# Altium project Battery Reader.PrjPcb
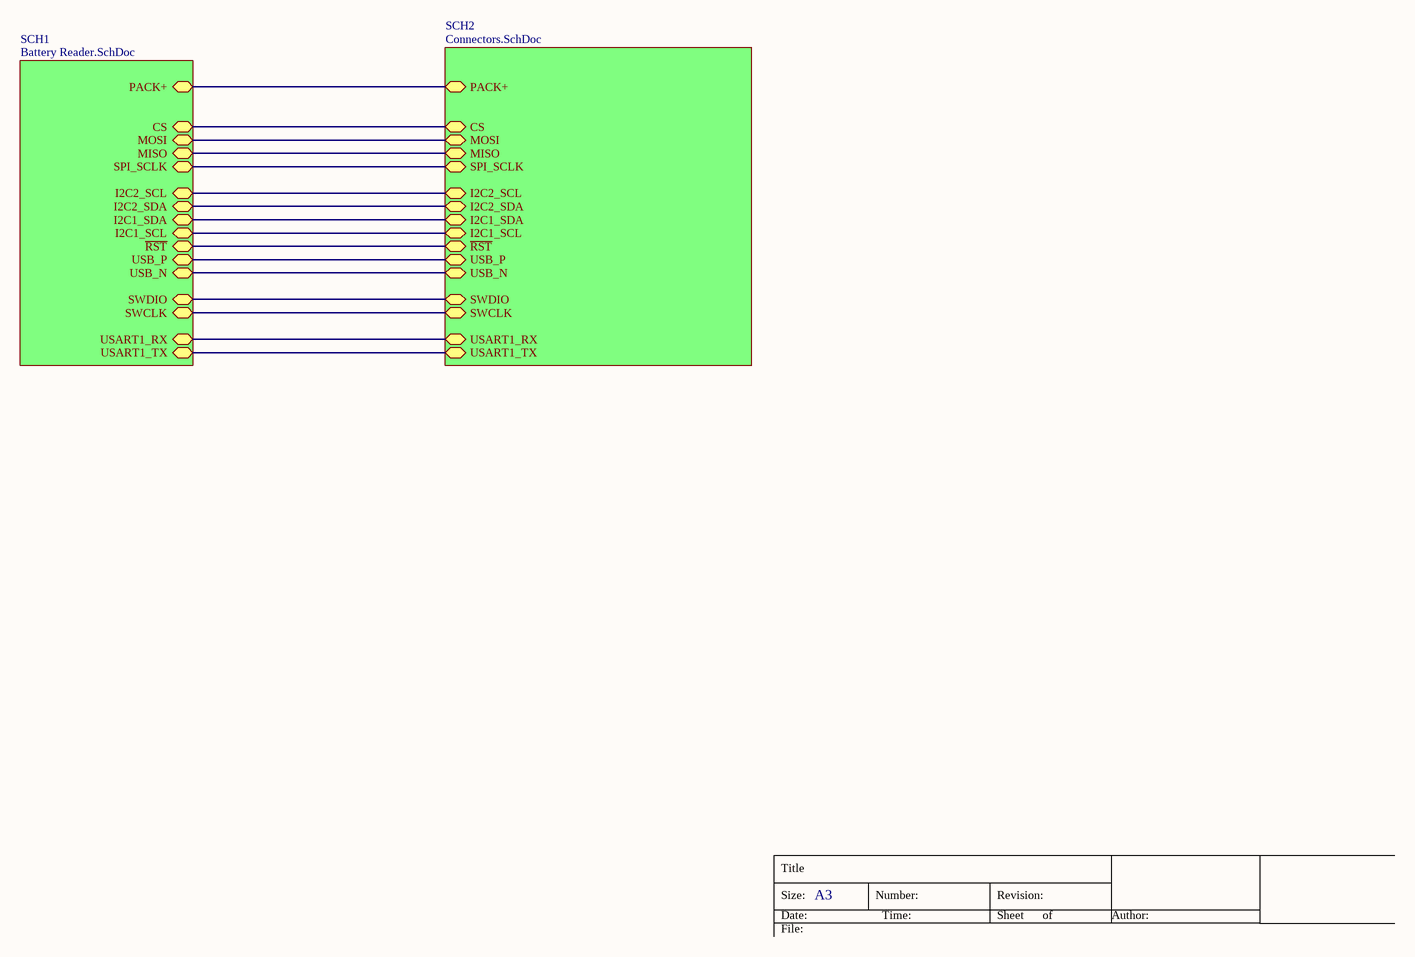
[diagram p0: Toplevel.SchDoc]
3 sheets, 73 parts. Net scope: hierarchical (ports join the sheet entries above them; power ports are global).
Board file: Battery Reader.PcbDoc
Sheets:
  Toplevel.SchDoc
    SCH1 = Battery Reader.SchDoc
    SCH2 = Connectors.SchDoc

## Sheet Toplevel.SchDoc: Toplevel
size A3; Author: Borja Serra; CompanyName: Blueye Robotics; Organization: Blueye Robotics AS; Address1: Transittgata 10; Address2: 7042 Trondheim; Address3: Norway; Revision: 0; SheetNumber: 1; SheetTotal: 3

### Sub-sheets
SCH1 = Battery Reader.SchDoc: CS, ~{RST}, MOSI, MISO, SPI_SCLK, USB_P, USB_N, I2C1_SDA, I2C1_SCL, PACK+, SWDIO, USART1_RX, SWCLK, USART1_TX, I2C2_SCL, I2C2_SDA
SCH2 = Connectors.SchDoc: CS, MISO, USB_P, MOSI, SPI_SCLK, I2C1_SCL, I2C1_SDA, ~{RST}, USB_N, PACK+, SWDIO, USART1_TX, USART1_RX, SWCLK, I2C2_SCL, I2C2_SDA

### Nets
I2C1_SCL: sheet SCH1/I2C1_SCL, sheet SCH2/I2C1_SCL
I2C1_SDA: sheet SCH1/I2C1_SDA, sheet SCH2/I2C1_SDA
PACK+: sheet SCH1/PACK+, sheet SCH2/PACK+
~{RST}: sheet SCH1/~{RST}, sheet SCH2/~{RST}
SWCLK: sheet SCH1/SWCLK, sheet SCH2/SWCLK
SWDIO: sheet SCH1/SWDIO, sheet SCH2/SWDIO
USART1_RX: sheet SCH1/USART1_RX, sheet SCH2/USART1_RX
USART1_TX: sheet SCH1/USART1_TX, sheet SCH2/USART1_TX
USB_N: sheet SCH1/USB_N, sheet SCH2/USB_N
USB_P: sheet SCH1/USB_P, sheet SCH2/USB_P
NetConn2_5: sheet SCH1/MISO, sheet SCH2/MISO
NetConn2_6: sheet SCH1/MOSI, sheet SCH2/MOSI
NetConn2_7: sheet SCH1/SPI_SCLK, sheet SCH2/SPI_SCLK
NetConn2_8: sheet SCH1/CS, sheet SCH2/CS
NetP1_D5: sheet SCH1/I2C2_SDA, sheet SCH2/I2C2_SDA
NetP1_D6: sheet SCH1/I2C2_SCL, sheet SCH2/I2C2_SCL

### Notes on the sheet
- Title
- Size:
- Date:
- A3
- Number:
- Time:
- Revision:
- Sheet
- of
- Author:
- File:

## Sheet Battery Reader.SchDoc: Battery Reader
size A3; Author: Borja Serra; CompanyName: Blueye Robotics; Organization: Blueye Robotics AS; Address1: Transittgata 10; Address2: 7042 Trondheim; Address3: Norway; Revision: 0; SheetNumber: 2; SheetTotal: 3
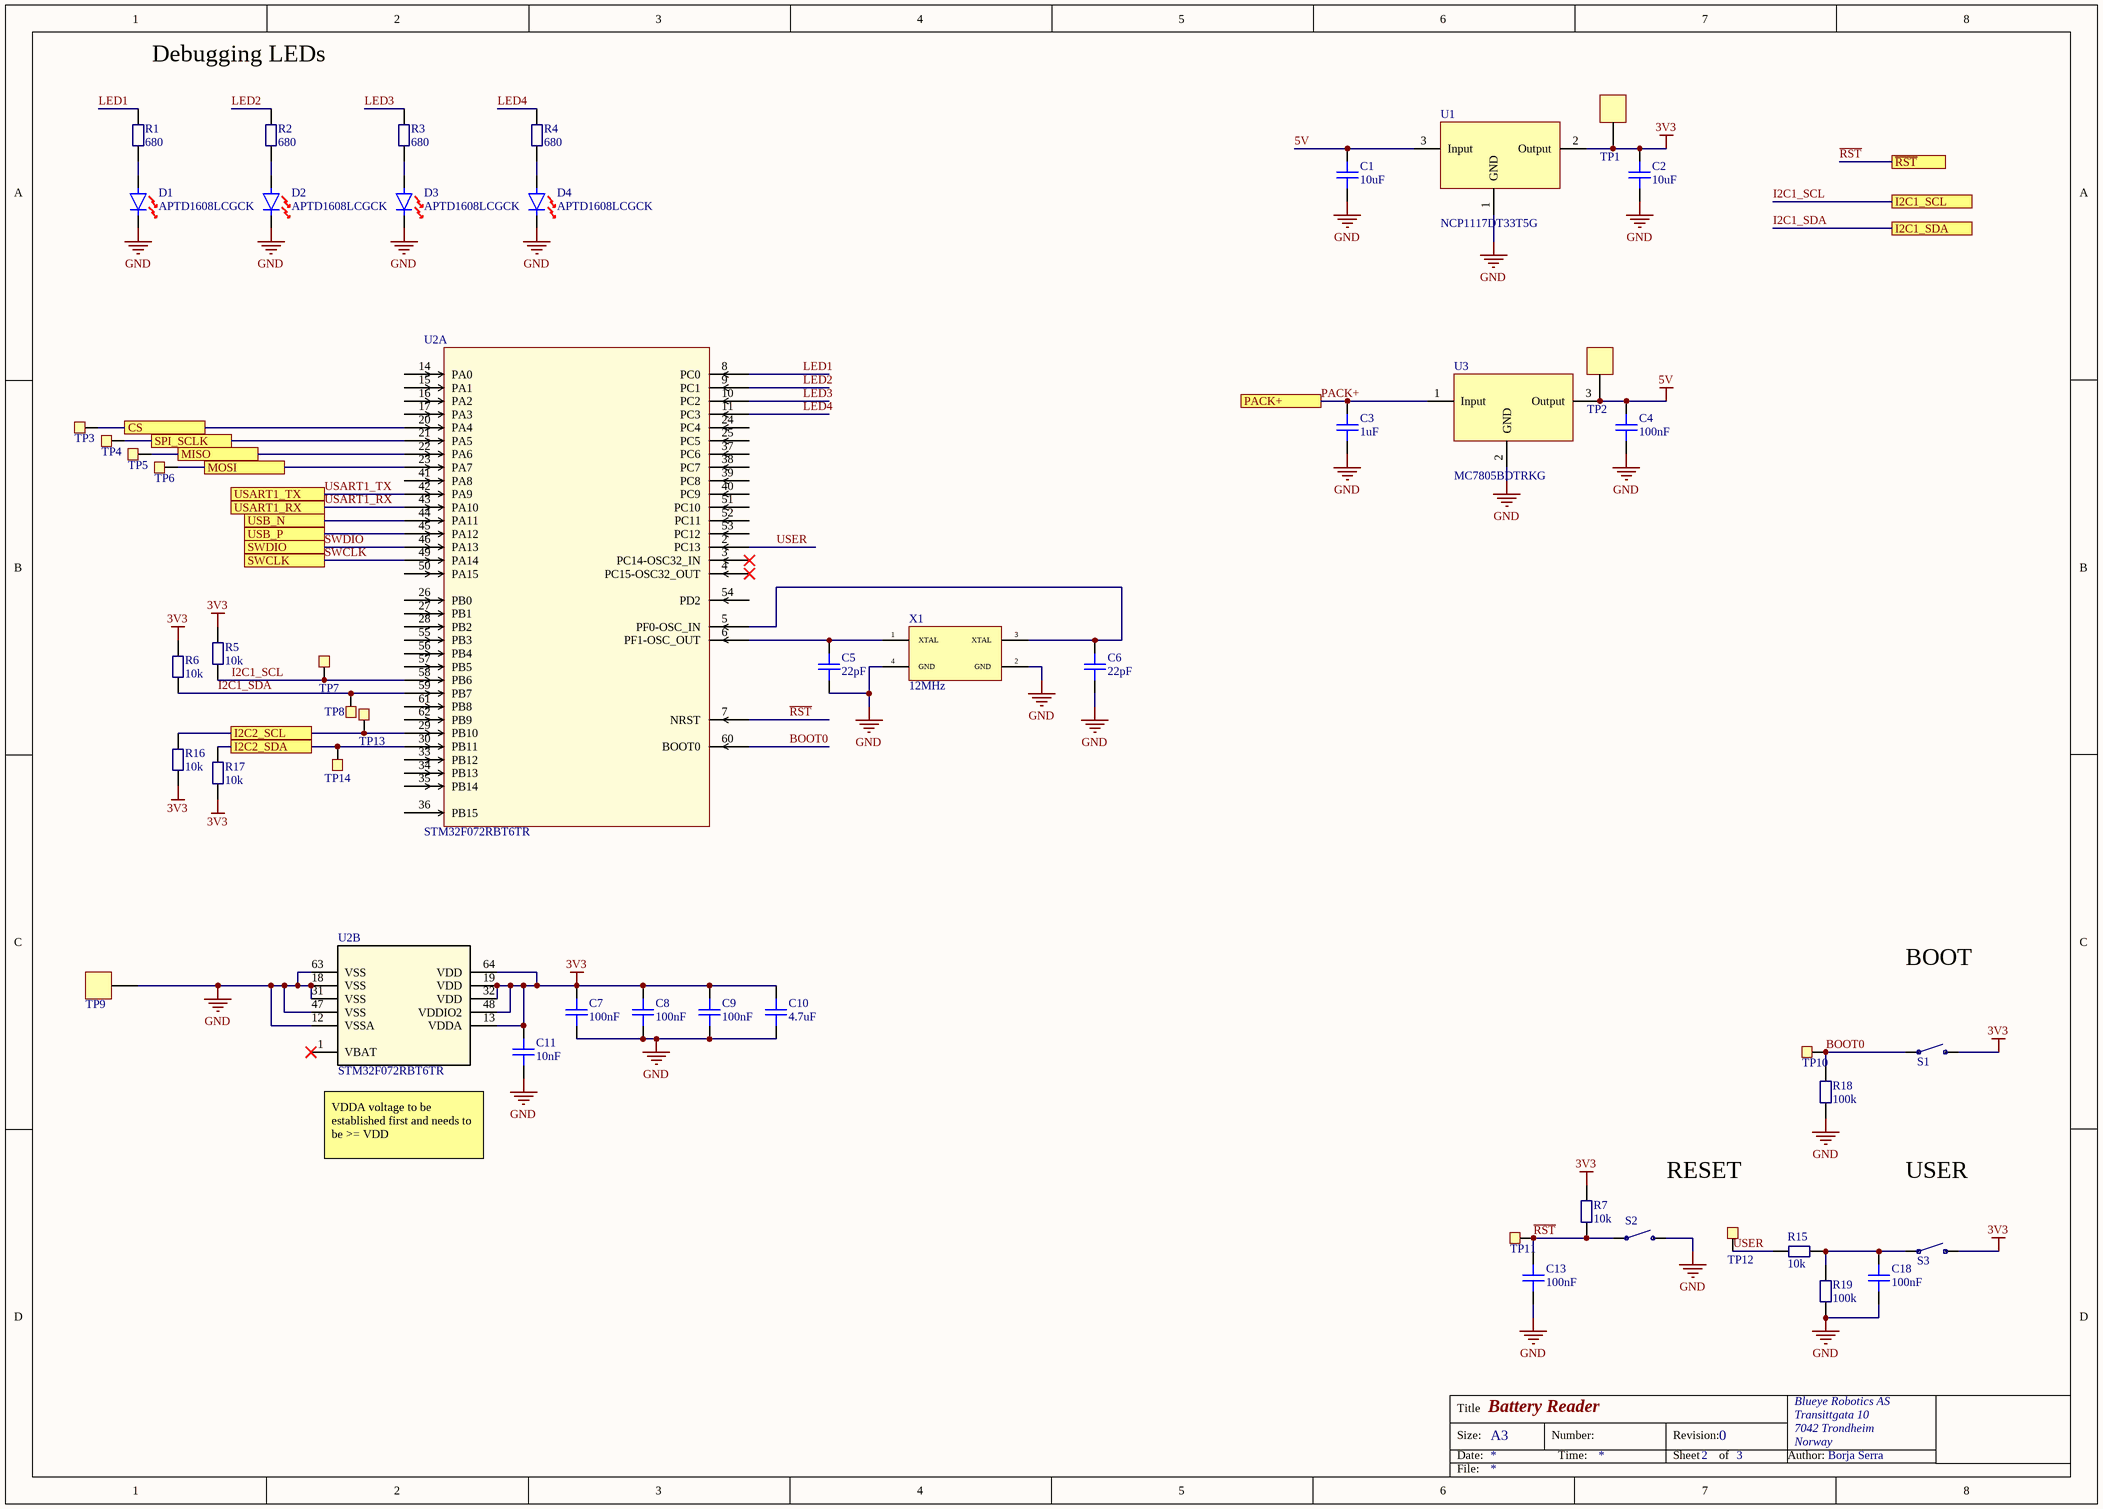
[diagram p1: Battery Reader.SchDoc]

### Parts
C1  10uF  [1206 CAPACITOR]
C2  10uF  [1206 CAPACITOR]
C3  1uF  [1206 CAPACITOR]
C4  100nF  [0603 Capacitor]
C5  22pF  [0603 Capacitor]
C6  22pF  [0603 Capacitor]
C7  100nF  [0603 Capacitor]
C8  100nF  [0603 Capacitor]
C9  100nF  [0603 Capacitor]
C10  4.7uF  [0805 Capacitor]
C11  10nF  [0603 Capacitor]
C13  100nF  [0603 Capacitor]
C18  100nF  [0603 Capacitor]
D1  APTD1608LCGCK  [0603 LED]
D2  APTD1608LCGCK  [0603 LED]
D3  APTD1608LCGCK  [0603 LED]
D4  APTD1608LCGCK  [0603 LED]
R1  680  [0603 Resistor]
R2  680  [0603 Resistor]
R3  680  [0603 Resistor]
R4  680  [0603 Resistor]
R5  10k  [0603 Resistor]
R6  10k  [0603 Resistor]
R7  10k  [0603 Resistor]
R15  10k  [0603 Resistor]
R16  10k  [0603 Resistor]
R17  10k  [0603 Resistor]
R18  100k  [0603 Resistor]
R19  100k  [0603 Resistor]
S1  Tactile Switches Reset  [Tact Switch - panasonic]  (value not drawn)
S2  Tactile Switches Reset  [Tact Switch - panasonic]  (value not drawn)
S3  Tactile Switches Reset  [Tact Switch - panasonic]  (value not drawn)
TP1  3122-2-00-15-00-00-08-0  [3122-2-00-15-00-00-08-0]  (value not drawn)
TP2  3122-2-00-15-00-00-08-0  [3122-2-00-15-00-00-08-0]  (value not drawn)
TP3  Testpoint  [Testpoint]  (value not drawn)  (no BOM)
TP4  Testpoint  [Testpoint]  (value not drawn)  (no BOM)
TP5  Testpoint  [Testpoint]  (value not drawn)  (no BOM)
TP6  Testpoint  [Testpoint]  (value not drawn)  (no BOM)
TP7  Testpoint  [Testpoint]  (value not drawn)  (no BOM)
TP8  Testpoint  [Testpoint]  (value not drawn)  (no BOM)
TP9  3122-2-00-15-00-00-08-0  [3122-2-00-15-00-00-08-0]  (value not drawn)
TP10  Testpoint  [Testpoint]  (value not drawn)  (no BOM)
TP11  Testpoint  [Testpoint]  (value not drawn)  (no BOM)
TP12  Testpoint  [Testpoint]  (value not drawn)  (no BOM)
TP13  Testpoint  [Testpoint]  (value not drawn)  (no BOM)
TP14  Testpoint  [Testpoint]  (value not drawn)  (no BOM)
U1  NCP1117DT33T5G  [DPAK-3]
U2  STM32F072RBT6TR  [LQFP64-10x10mm]  (parts A,B of 2)
U3  MC7805BDTRKG  [DPAK-3]
X1  12MHz  [FH1200001 12MHz]

### Ports
CS, I2C1_SCL, I2C1_SDA, I2C2_SCL, I2C2_SDA, MISO, MOSI, PACK+, SPI_SCLK, SWCLK, SWDIO, USART1_RX, USART1_TX, USB_N, USB_P, ~{RST}

### Nets
3V3: C2.2 C7.2 C8.2 C9.2 C10.2 C11.2 R5.2 R6.2 R7.2 R16.1 R17.1 S1.2 S3.2 TP1.1 U1.2(Output) U2.13(VDDA) U2.19(VDD) U2.32(VDD) U2.48(VDDIO2) U2.64(VDD)
5V: C1.2 C4.2 TP2.1 U1.3(Input) U3.3(Output)
GND: C1.1 C2.1 C3.1 C4.1 C5.1 C6.1 C7.1 C8.1 C9.1 C10.1 C11.1 C13.1 C18.1 D1.1 D2.1 D3.1 D4.1 R18.1 R19.1 S2.2 TP9.1 U1.1(GND) U2.12(VSSA) U2.18(VSS) U2.31(VSS) U2.47(VSS) U2.63(VSS) U3.2(GND) X1.2(GND) X1.4(GND)
BOOT0: R18.2 S1.1 TP10.1 U2.60(BOOT0)
I2C1_SCL: R5.1 TP7.1 U2.58(PB6) ; port I2C1_SCL
I2C1_SDA: R6.1 TP8.1 U2.59(PB7) ; port I2C1_SDA
LED1: R1.2 U2.8(PC0)
LED2: R2.2 U2.9(PC1)
LED3: R3.2 U2.10(PC2)
LED4: R4.2 U2.11(PC3)
PACK+: C3.2 U3.1(Input) ; port PACK+
~{RST}: C13.2 R7.1 S2.1 TP11.1 U2.7(NRST) ; port ~{RST}
SWCLK: U2.49(PA14) ; port SWCLK
SWDIO: U2.46(PA13) ; port SWDIO
USART1_RX: U2.43(PA10) ; port USART1_RX
USART1_TX: U2.42(PA9) ; port USART1_TX
USB_N: U2.44(PA11) ; port USB_N
USB_P: U2.45(PA12) ; port USB_P
USER: R15.1 TP12.1 U2.2(PC13)
NetC5_2: C5.2 U2.6(PF1-OSC_OUT) X1.1(XTAL)
NetC6_2: C6.2 U2.5(PF0-OSC_IN) X1.3(XTAL)
NetC18_2: C18.2 R15.2 R19.2 S3.1
NetConn2_5: TP5.1 U2.22(PA6) ; port MISO
NetConn2_6: TP6.1 U2.23(PA7) ; port MOSI
NetConn2_7: TP4.1 U2.21(PA5) ; port SPI_SCLK
NetConn2_8: TP3.1 U2.20(PA4) ; port CS
NetD1_2: D1.2 R1.1
NetD2_2: D2.2 R2.1
NetD3_2: D3.2 R3.1
NetD4_2: D4.2 R4.1
NetP1_D5: R17.2 TP14.1 U2.30(PB11) ; port I2C2_SDA
NetP1_D6: R16.2 TP13.1 U2.29(PB10) ; port I2C2_SCL

Not connected (* = marked no-connect by the designer): U2 1(VBAT)* 3(PC14-OSC32_IN)* 4(PC15-OSC32_OUT)* 14(PA0) 15(PA1) 16(PA2) 17(PA3) 24(PC4) 25(PC5) 26(PB0) 27(PB1) 28(PB2) 33(PB12) 34(PB13) 35(PB14) 36(PB15) 37(PC6) 38(PC7) 39(PC8) 40(PC9) 41(PA8) 50(PA15) 51(PC10) 52(PC11) 53(PC12) 54(PD2) 55(PB3) 56(PB4) 57(PB5) 61(PB8) 62(PB9)

### Notes on the sheet
- Debugging LEDs
- BOOT
- VDDA voltage to be established first and needs to be >= VDD
- RESET
- USER
- Title
- Size:
- Date:
- A3
- Number:
- Time:
- Revision:
- Sheet
- of
- Author:
- File:

### Library data of the parts
C1 C2 = CAP CER 10UF 35V X7R 1206: MPN: GMK316AB7106KL-TR; Manufacturer: Taiyo Yuden; value: 10uF; Supplier 1: Digi-Key; Supplier Part Number 1: 587-3007-1-ND
C3 = Capacitor 1uF 50V: Multilayer Ceramic Capacitors MLCC - SMD/SMT 1206 1.0uF 50V X7R 20%; Manufacturer: TDK; MPN: C3216X7R1H105M160AB; SPN: 810-C3216X7R1H105M; Supplier: Mouser
C4 C7-C9 C13 C18 = CAP CER 0.1UF 50V X7R 0603: MPN: CL10B104KB8NNNC; Manufacturer: Samsung Electro-Mechanics; value: 100nF; Supplier 1: Digi-Key; Supplier Part Number 1: 1276-1000-1-ND
C5 C6 = CAP CER 22PF 50V X7R 0603: MPN: 06035C220JAT2A; Manufacturer: AVX Corporation; value: 22pF; Supplier 1: Digi-Key; Supplier Part Number 1: 478-6204-1-ND
C10 = Capacitor 4.7uF 25V: Multilayer Ceramic Capacitors MLCC - SMD/SMT 4.7uF 25Volts 10%; Manufacturer: Murata Electronics; MPN: GRM21BR61E475KA12K; SPN: 81-GRM21BR61E475KA2K; Supplier: Mouser
C11 = Capacitor 10nF: Multilayer CeramicCapacitors MLCC - SMD/SMT 100volts .01uF 10% X7R AUTO ESD; MPN: C0603C103K1RECAUTO; Manufacturer: Kemet; SPN: 80-C0603C103K1REAUTO; Supplier: Mouser
D1-D4 = Standard LEDs - SMD 0603 Dome Lens LED Green- 570nm: Manufacturer: Kingbright; SPN: 604-APTD1608LCGCK; Supplier: Digi-Key; MPN: APTD1608LCGCK
R1-R4 = resistor 680 ohm: Thick Film Resistors - SMD 0603 680ohms 5% AEC-Q200; MPN: ERJ-3GEYJ681V; Manufacturer: Panasonic; SPN: 667-ERJ-3GEYJ681V; Supplier: Mouser
R5-R7 R15-R17 = RES SMD 10K OHM 5% 1/10W 0603: Manufacturer: Yageo; MPN: RC0603JR-0710KL; Supplier Part Number 1: 311-10KGRCT-ND; Supplier 1: Digi-Key; Value: 10k
R18 R19 = RES SMD 100K OHM 5% 1/10W 0603: MPN: RC0603JR-07100KL; Manufacturer: Yageo; Value: 100k; Supplier 1: Digi-Key; Supplier Part Number 1: 311-100KGRCT-ND
S1-S3 = Tactile Switches Reset: Tactile Switches 6.0x3.5mm SMD Light Touch Switch; Manufacturer: Panasonic; MPN: EVQ-PE105K; SPN: 667-EVQ-PE105K; Supplier: Mouser
TP1 TP2 TP9 = 3122-2-00-15-00-00-08-0: CONN PC PIN CIRC 0.040DIA GOLD; Manufacturer: Mill-Max; Manufacturer Part Number: 3123-2-00-15-00-00-08-0; SPN: ED1277-ND; Plating: Nickel,Gold; Gender: Male; Insulation: Non-Insulated; Outside Diameter: 1.78mm; Flange Diameter: 0.07inch; Mounting Hole Diameter: 1.09mm; Board Thickness: 0.062inch; Hole Diameter: 0.043inch; MPN: 3122-2-00-15-00-00-08-0; Supplier: Digi-Key; Supplier 1: Digi-Key; Stock 1: 3576; Pricing 1: 1=0.34, 10=0.323, 25=0.2768, 50=0.2354, 100=0.2261, 250=0.2031, 500=0.1938, 1000=0.1615, 2500=0.1477 (USD); Mount: Through Hole; Contact Material: Brass; Material: Brass; Contact Plating: Gold; Package Quantity: 500; Packaging: Bulk; Termination: PC Pin; Length: 0.682inch; ComponentLink1URL: http://www.mouser.com/ds/2/273/221M-269451.pdf; ComponentLink1Description: http://www.mouser.com/ds/2/273/221M-269451.pdf; ComponentLink2URL: http://www.mill-max.com/assets/pdfs/metric/221M.pdf; ComponentLink2Description: http://www.mill-max.com/assets/pdfs/metric/221M.pdf; Supplier Part Number 1: ED1182-ND
U1 = IC REG LINEAR 3.3V 1A DPAK-3: Manufacturer: ON Semiconductor; SPN: NCP1117DT33T5GOSCT-ND; Supplier: Digi-Key; MPN: NCP1117DT33T5G
U2 = STM32F072RBT6TR: Vendor: STMicroelectronics; C: Copyright (C) 2016 Accelerated Designs. All rights reserved; SPN: 497-17363-1-ND; Copyright: Copyright (C) 2016 Accelerated Designs. All rights reserved; Manufacturer_Part_Number: STM32F072RBT6TR; RefDes: RefDes; Type: Type; Value: Value; Supplier: Digi-Key; MPN: STM32F072RBT6TR
U3 = IC REG LINEAR 5V 1A DPAK-3: Manufacturer: ON Semiconductor; SPN: MC7805BDTRKGOSCT-ND; Supplier: Digi-Key; MPN: MC7805BDTRKG
X1 = Crystal 12MHz: Manufacturer: Pericom; MPN: FH1200001; SPN: 729-FH1200001; Supplier: Mouser

## Sheet Connectors.SchDoc: Connectors
size A3; Author: Borja Serra; CompanyName: Blueye Robotics; Organization: Blueye Robotics AS; Address1: Transittgata 10; Address2: 7042 Trondheim; Address3: Norway; Revision: 0; SheetNumber: 3; SheetTotal: 3
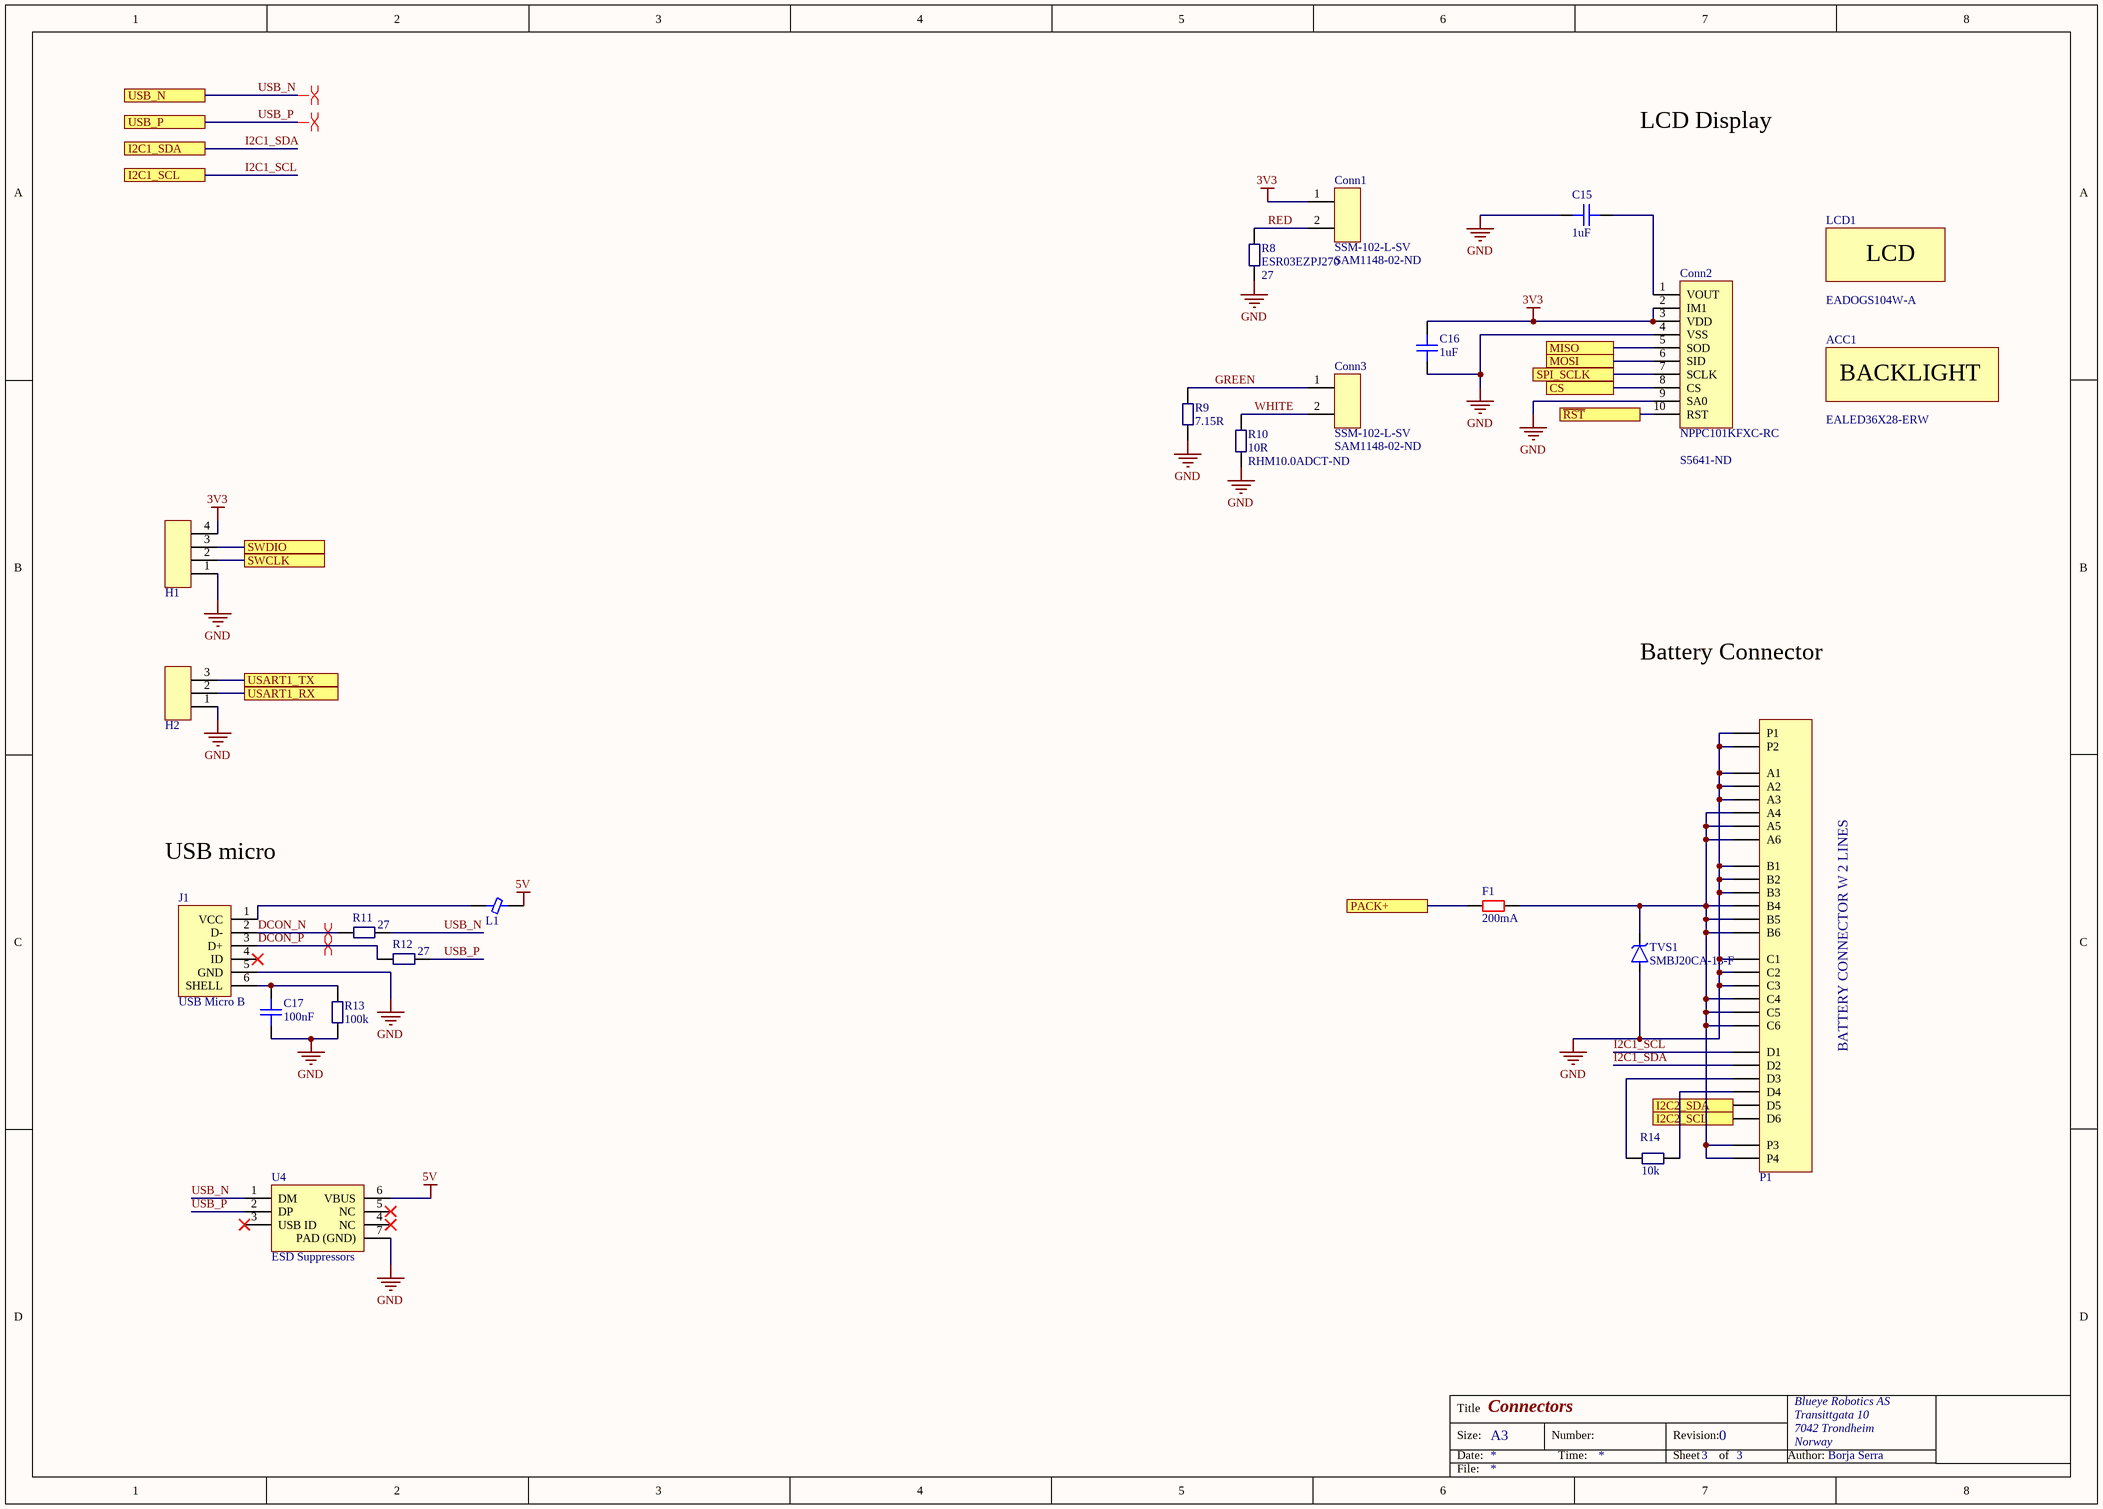
[diagram p2: Connectors.SchDoc]

### Parts
ACC1  Manufacturer Part Number 1: EALED36X28-ERW  (graphical)
C15  1uF  [1206 CAPACITOR]
C16  1uF  [1206 CAPACITOR]
C17  100nF  [0603 Capacitor]  (no BOM)
Conn1  SSM-102-L-SV  Supplier Part Number 1: SAM1148-02-ND  [CON2_1X2_DU_SSM]
Conn2  NPPC101KFXC-RC  Supplier Part Number 1: S5641-ND  [CONN FMALE 10POS .1" SMD GOLD]
Conn3  SSM-102-L-SV  Supplier Part Number 1: SAM1148-02-ND  [CON2_1X2_DU_SSM]
F1  200mA  [0603 Resistor]
H1  Header 4pin SMD  [Header 4pos 100 mil SMD]  (value not drawn)
H2  Header 3pin SMD  [Header 3pos 100 mil SMD]  (value not drawn)
J1  USB Micro B  [10118193-0001LF Micro USB]
L1  60 OHM  [0805 Capacitor]  (value not drawn)
LCD1  Manufacturer Part Number 1: EADOGS104W-A  (graphical)
P1  MPTC-02-24-02-6.30-XX-X-V-LC  [MPTC-02-24-02-6.30-XX-X-V-LC]  (value not drawn)
R8  ESR03EZPJ270  value 27  [0603 Resistor]
R9  Resistance: 7.15R  [0603 Resistor]  (hidden comment: CRCW06037R15FKEA)
R10  10R  Supplier Part Number 1: RHM10.0ADCT-ND  [0603 Resistor]
R11  value 27  [0603 Resistor]  (hidden comment: ESR03EZPJ270)
R12  value 27  [0603 Resistor]  (hidden comment: ESR03EZPJ270)
R13  100k  [0603 Resistor]  (no BOM)
R14  10k  [0603 Resistor]
TVS1  SMBJ20CA-13-F  [TVS diode]
U4  ESD Suppressors  [RCLAMP0854P.TCT - SON50P160X65_HS-7N]

### Ports
CS, I2C1_SCL, I2C1_SDA, I2C2_SCL, I2C2_SDA, MISO, MOSI, PACK+, SPI_SCLK, SWCLK, SWDIO, USART1_RX, USART1_TX, USB_N, USB_P, ~{RST}

### Nets
3V3: C16.1 Conn1.1 Conn2.2(IM1) Conn2.3(VDD) H1.4
5V: L1.2(L2) U4.6(VBUS)
GND: C15.2 C16.2 C17.1 Conn2.4(VSS) Conn2.9(SA0) H1.1 H2.1 J1.5(GND) P1.A1 P1.A2 P1.A3 P1.B1 P1.B2 P1.B3 P1.C1 P1.C2 P1.C3 P1.P1 P1.P2 R8.1 R9.1 R10.1 R13.1 TVS1.2 U4.7(PAD_(GND))
DCON_N: J1.2(D-) R11.1
DCON_P: J1.3(D+) R12.1
GREEN: Conn3.1 R9.2
I2C1_SCL: P1.D1 ; port I2C1_SCL
I2C1_SDA: P1.D2 ; port I2C1_SDA
PACK+: F1.1 ; port PACK+
~{RST}: Conn2.10(RST) ; port ~{RST}
RED: Conn1.2 R8.2
SWCLK: H1.2 ; port SWCLK
SWDIO: H1.3 ; port SWDIO
USART1_RX: H2.2 ; port USART1_RX
USART1_TX: H2.3 ; port USART1_TX
USB_N: R11.2 U4.1(DM) ; port USB_N
USB_P: R12.2 U4.2(DP) ; port USB_P
WHITE: Conn3.2 R10.2
NetC15_1: C15.1 Conn2.1(VOUT)
NetC17_2: C17.2 J1.6(SHELL) R13.2
NetConn2_5: Conn2.5(SOD) ; port MISO
NetConn2_6: Conn2.6(SID) ; port MOSI
NetConn2_7: Conn2.7(SCLK) ; port SPI_SCLK
NetConn2_8: Conn2.8(CS) ; port CS
NetF1_2: F1.2 P1.A4 P1.A5 P1.A6 P1.B4 P1.B5 P1.B6 P1.C4 P1.C5 P1.C6 P1.P3 P1.P4 TVS1.1
NetJ1_1: J1.1(VCC) L1.1(L1)
NetP1_D3: P1.D3 R14.1
NetP1_D4: P1.D4 R14.2
NetP1_D5: P1.D5 ; port I2C2_SDA
NetP1_D6: P1.D6 ; port I2C2_SCL

Not connected (* = marked no-connect by the designer): J1 4(ID)*; U4 3(USB_ID)* 4(NC)* 5(NC)*

### Layout directives
differential pair: DCON_N, DCON_P, USB_N, USB_P

### Notes on the sheet
- LCD Display
- Battery Connector
- (near J1) USB micro
- BATTERY CONNECTOR W 2 LINES
- Title
- Size:
- Date:
- A3
- Number:
- Time:
- Revision:
- Sheet
- of
- Author:
- File:
- (in symbol 4X10 DOG CHARACTERDISPLAY) LCD
- (in symbol LED BACKLIT F. EA DOGS104) BACKLIGHT

### Library data of the parts
ACC1 = LED BACKLIT F. EA DOGS104: Manufacturer 1: Electronic Assembly; Supplier 1: Digi-Key; Stock 1: 9; Pricing 1: 1=14.66, 10=14.04, 25=10.92, 100=9.36, 250=8.892, 500=8.424, 1000=7.956 (USD); ComponentLink1URL: http://www.mouser.com/ds/2/127/dogs104e-553061.pdf; ComponentLink1Description: http://www.mouser.com/ds/2/127/dogs104e-553061.pdf; Supplier Part Number 1: 1481-1235-ND
C15 C16 = Capacitor 1uF 50V: as C3 on sheet Battery Reader; Supplier: Mouser
C17 = CAP CER 0.1UF 50V X7R 0603: as C4 on sheet Battery Reader; value: 100nF; Supplier 1: Digi-Key; Supplier Part Number 1: 1276-1000-1-ND
Conn1 Conn3 = CONN RCPT .100" 2POS SNGL VERT: Manufacturer 1: Samtec; Description 1: SAMTEC         SSM-102-L-SV             Board-To-Board Connector, Vertical, SSM Series, 2 Contacts, Receptacle, 2.54 mm, Surface Mount; Contact Resistance: 10mR; Max Current Rating: 6.9A; Number of Positions: 2; Gender: Receptacle; Connector Type: Receptacle,Socket; Pitch: 2.54mm; Max Voltage Rating (AC): 475V; MPN: SSM-102-L-SV; Supplier 1: Digi-Key; Manufacturer Part Number 1: SSM-102-L-SV; Stock 1: 339; Pricing 1: 1=2.18, 10=1.953, 100=1.6081, 500=1.2711, 1000=1.0912, 5000=0.9955, 10000=0.9572 (USD); Mount: Surface Mount; Colour: Black; Housing Colour: Black; Housing Material: Polymer; Contact Plating: Nickel,Gold; Contact Material: Bronze; Min Operating Temperature: -55°C; Max Operating Temperature: 125°C; Number of Rows: 1; Packaging: Bulk; Termination: Solder; Number of Contacts: 2; Orientation: Straight; Length: 5.08mm; Depth: 2.54mm; Radiation Hardening: No; ComponentLink1URL: https://datasheet.ciiva.com/25617/0900766b811594ab-25617394.pdf; ComponentLink1Description: https://datasheet.ciiva.com/25617/0900766b811594ab-25617394.pdf; ComponentLink2URL: https://datasheet.ciiva.com/746/ssm-1xx-xxx-xx-xx-xx-x-xx-xx-mkt-746741.pdf; ComponentLink2Description: https://datasheet.ciiva.com/746/ssm-1xx-xxx-xx-xx-xx-x-xx-xx-mkt-746741.pdf; ComponentLink3URL: https://datasheet.ciiva.com/22677/81944-22677814.pdf; ComponentLink3Description: https://datasheet.ciiva.com/22677/81944-22677814.pdf; Current Rating: 6.9A; Voltage Rating: 475V; Voltage Rating (AC): 475V; Lead Pitch: 2.54mm; Lead Free: Lead Free; REACH SVHC: No SVHC
Conn2 = CONN FMALE 10POS .1" SMD GOLD: Manufacturer 1: Sullins; Pitch: 0.1inch; Number of Positions: 10; Connector Type: Socket,Header; MPN: NPPC101KFXC-RC; Manufacturer: NPPC101KFXC-RC; Supplier 1: Digi-Key; Manufacturer Part Number 1: NPPC101KFXC-RC; Stock 1: 1156; Pricing 1: 1=1.32, 10=1.195, 100=1.0244, 500=0.8537, 1000=0.7317, 5000=0.7046 (USD); Contact Plating: Gold; Contact Material: Bronze; Housing Colour: Black; Housing Material: Nylon; Number of Rows: 1; Packaging: Bulk; Termination: Solder; Length: 25.4mm; Lead Free: Lead Free; ComponentLink1URL: https://datasheet.ciiva.com/745/npxcxx1kfxx-rc10487-d-745368.pdf; ComponentLink1Description: https://datasheet.ciiva.com/745/npxcxx1kfxx-rc10487-d-745368.pdf; Description 1: CONN FMALE 10POS .1" SMD GOLD; Mount: Surface Mount; Colour: Black; Package Quantity: 1; Height: 7.1mm; Width: 2.5mm
F1 = Fuse 200mA 0603: MPN: F0603G0R20FNTR; Manufacturer: AVX Corporation; SPN: 478-6874-1-ND; Supplier: Digi-Key
H1 = Header 4pin SMD: CONN HEADER 4POS VERT 2.54MM SMD; Manufacturer: Molex, LLC; MPN: 0878980426; SPN: WM8617-ND; Supplier: Digikey
H2 = Header 3pin SMD: 3 Positions Header, Breakaway Connector 0.100" (2.54mm) Surface Mount Tin; Manufacturer: Molex, LLC; MPN: 0878980306; SPN: WM9810-ND; Supplier: Digikey
J1 = USB Micro B: USB Connectors 5P MICRO USB TYPE B RECEPTACLE W/ PEGS; Manufacturer: Amphenol FCI; MPN: 10118193-0001LF; SPN: 649-10118193-0001LF; Supplier: Mouser
L1 = FERRITE BEAD 60 ohm: FERRITE BEAD 60 OHM 0805 1LN; Manufacturer: Taiyo Yuden; MPN: BKP2125HS600-T; SPN: 587-1932-1-ND; Supplier: Digikey
LCD1 = 4X10 DOG CHARACTERDISPLAY: Manufacturer 1: Electronic Assembly; Supplier 1: Mouser; Stock 1: 0; Pricing 1: 1=16.68, 10=15.97, 50=12.42, 100=10.64, 1000=9.58, 10000=9.58 (USD); ComponentLink1URL: http://www.mouser.com/ds/2/127/dogs104e-553061.pdf; ComponentLink1Description: http://www.mouser.com/ds/2/127/dogs104e-553061.pdf; Supplier Part Number 1: 790-EADOGS104W-A
P1 = MPTC-02-24-02-6.30-XX-X-V-LC: Samtec PowerStrip 30A Signal/Power Combo Connector; MPN: MPTC-02-24-02-6.30-01-L-V; Manufacturer: Samtec
R8 R11 R12 = RES SMD 27 OHM 5% 1/4W 0603: Manufacturer 1: Rohm; Resistance: 27R; Max Power Dissipation: 250mW; Temperature Coefficient: 200ppm/°C; MPN: ESR03EZPJ270; Supplier 1: Digi-Key; Manufacturer Part Number 1: ESR03EZPJ270; Description 1: RES SMD 27 OHM 5% 1/4W 0603; Stock 1: 22229; Pricing 1: 1=0.1, 10=0.087, 100=0.0333, 1000=0.0146, 2500=0.0126 (USD); Case/Package: 0603; Case Code (Metric): 1608; Case Code (Imperial): 0603; Min Operating Temperature: -55°C; Max Operating Temperature: 155°C; Package Quantity: 5000; Packaging: Cut Tape; Tolerance: 5%; Composition: Thick Film; Number of Terminations: 2; Length: 0.063inch; Height: 0.022inch; Width: 0.031inch; ComponentLink1URL: https://datasheet.ciiva.com/14932/esr-14932374.pdf; ComponentLink1Description: https://datasheet.ciiva.com/14932/esr-14932374.pdf; ComponentLink2URL: https://datasheet.ciiva.com/14928/esr-14928807.pdf; ComponentLink2Description: https://datasheet.ciiva.com/14928/esr-14928807.pdf; Supplier Part Number 1: RHM27DCT-ND
R9 = RES SMD 7.15 OHM 1% 1/10W 0603: Manufacturer 1: Vishay Dale; Power Rating: 100mW; Voltage Rating: 75V; Temperature Coefficient: 100ppm/°C; MPN: CRCW06037R15FKEA; Supplier 1: Digi-Key; Manufacturer Part Number 1: CRCW06037R15FKEA; Description 1: RES SMD 7.15 OHM 1% 1/10W 0603; Stock 1: 21491; Pricing 1: 1=0.1, 10=0.042, 100=0.017, 1000=0.0076, 2500=0.0066 (USD); Case/Package: 0603; Weight: 7.1E-05oz; Case Code (Metric): 1608; Case Code (Imperial): 0603; Contact Plating: Tin; Min Operating Temperature: -55°C; Max Operating Temperature: 155°C; Tolerance: 1%; Packaging: Tape and Reel; Package Quantity: 5000; Composition: Thick Film; Number of Terminations: 2; Military Standard: Not; Max Power Dissipation: 100mW; Length: 1.55mm; Height: 0.02inch; Width: 0.033inch; Depth: 0.85mm; Lead Free: Lead Free; ComponentLink1URL: https://datasheet.ciiva.com/2466/dcrcwe3-2466755.pdf; ComponentLink1Description: https://datasheet.ciiva.com/2466/dcrcwe3-2466755.pdf; ComponentLink2URL: https://datasheet.ciiva.com/2466/dcrcwe3-2466756.pdf; ComponentLink2Description: https://datasheet.ciiva.com/2466/dcrcwe3-2466756.pdf; ComponentLink3URL: https://datasheet.ciiva.com/2466/dcrcwe3-2466757.pdf; ComponentLink3Description: https://datasheet.ciiva.com/2466/dcrcwe3-2466757.pdf; ComponentLink4URL: https://datasheet.ciiva.com/5562/dcrcwe3-109170-5562726.pdf; ComponentLink4Description: https://datasheet.ciiva.com/5562/dcrcwe3-109170-5562726.pdf; Supplier Part Number 1: 541-7.15HHCT-ND
R10 = RES SMD 10 OHM 5% 1/4W 0603: Manufacturer: Rohm Semiconductor; MPN: ESR03EZPF10R0; Manufacturer 1: Rohm; Description 1: RES 10 OHM 1/4W 1% 0603 SMD; Tolerance: 1%; Temperature Coefficient: 100ppm/°C; Value: 10R; SPN: RHM10.0ADCT-ND; Supplier: DigiKey; Supplier 1: Digi-Key; Manufacturer Part Number 1: ESR03EZPF10R0; Stock 1: 261792; Pricing 1: 1=0.14, 10=0.126, 100=0.0484, 1000=0.0213, 2500=0.0184 (USD); Case/Package: 0603; Min Operating Temperature: -55°C; Max Operating Temperature: 155°C; Resistance: 10R; Length: 1.6mm; Height: 0.45mm; Width: 0.8mm; Lead Free: Lead Free; ComponentLink1URL: http://www.rohm.com/web/global/datasheet/ESR01MZPF/esr-e; ComponentLink1Description: http://www.rohm.com/web/global/datasheet/ESR01MZPF/esr-e
R13 = RES SMD 100K OHM 5% 1/10W 0603: Manufacturer: Yageo; MPN: RC0603JR-07100KL; Supplier Part Number 1: 311-100KGRCT-ND; Supplier 1: Digi-Key; Value: 100k
R14 = RES SMD 10K OHM 5% 1/10W 0603: as R5 on sheet Battery Reader; Value: 10k; Supplier Part Number 1: 311-10KGRCT-ND; Supplier 1: Digi-Key
TVS1 = TVS 20V: TVS DIODE 20VWM 32.4VC SMA; Manufacturer: Diodes Incorporated; SPN: SMBJ20CA-FDICT-ND; Supplier: Digikey; MPN: SMBJ20CA-13-F
U4 = ESD Suppressors: ESD Suppressors RCLAMP0854P 4LINES 8V SLP; Manufacturer: Semtech; MPN: RCLAMP0854P.TCT; SPN: 947-RCLAMP0854P.TCT; Supplier: Mouser

## Nets that join several sheets
3V3: Battery Reader (20 pins), Connectors (5 pins)
5V: Battery Reader (5 pins), Connectors (L1.2 U4.6)
GND: Battery Reader (30 pins), Connectors (25 pins)
I2C1_SCL: Battery Reader (R5.1 TP7.1 U2.58), Connectors (P1.D1)
I2C1_SDA: Battery Reader (R6.1 TP8.1 U2.59), Connectors (P1.D2)
NetConn2_5: Battery Reader (TP5.1 U2.22), Connectors (Conn2.5)
NetConn2_6: Battery Reader (TP6.1 U2.23), Connectors (Conn2.6)
NetConn2_7: Battery Reader (TP4.1 U2.21), Connectors (Conn2.7)
NetConn2_8: Battery Reader (TP3.1 U2.20), Connectors (Conn2.8)
NetP1_D5: Battery Reader (R17.2 TP14.1 U2.30), Connectors (P1.D5)
NetP1_D6: Battery Reader (R16.2 TP13.1 U2.29), Connectors (P1.D6)
PACK+: Battery Reader (C3.2 U3.1), Connectors (F1.1)
~{RST}: Battery Reader (5 pins), Connectors (Conn2.10)
SWCLK: Battery Reader (U2.49), Connectors (H1.2)
SWDIO: Battery Reader (U2.46), Connectors (H1.3)
USART1_RX: Battery Reader (U2.43), Connectors (H2.2)
USART1_TX: Battery Reader (U2.42), Connectors (H2.3)
USB_N: Battery Reader (U2.44), Connectors (R11.2 U4.1)
USB_P: Battery Reader (U2.45), Connectors (R12.2 U4.2)